# EasyEDA Pro project ProPrj_FOC_Driver V2.0_2024-06-09.epro, board PCB1
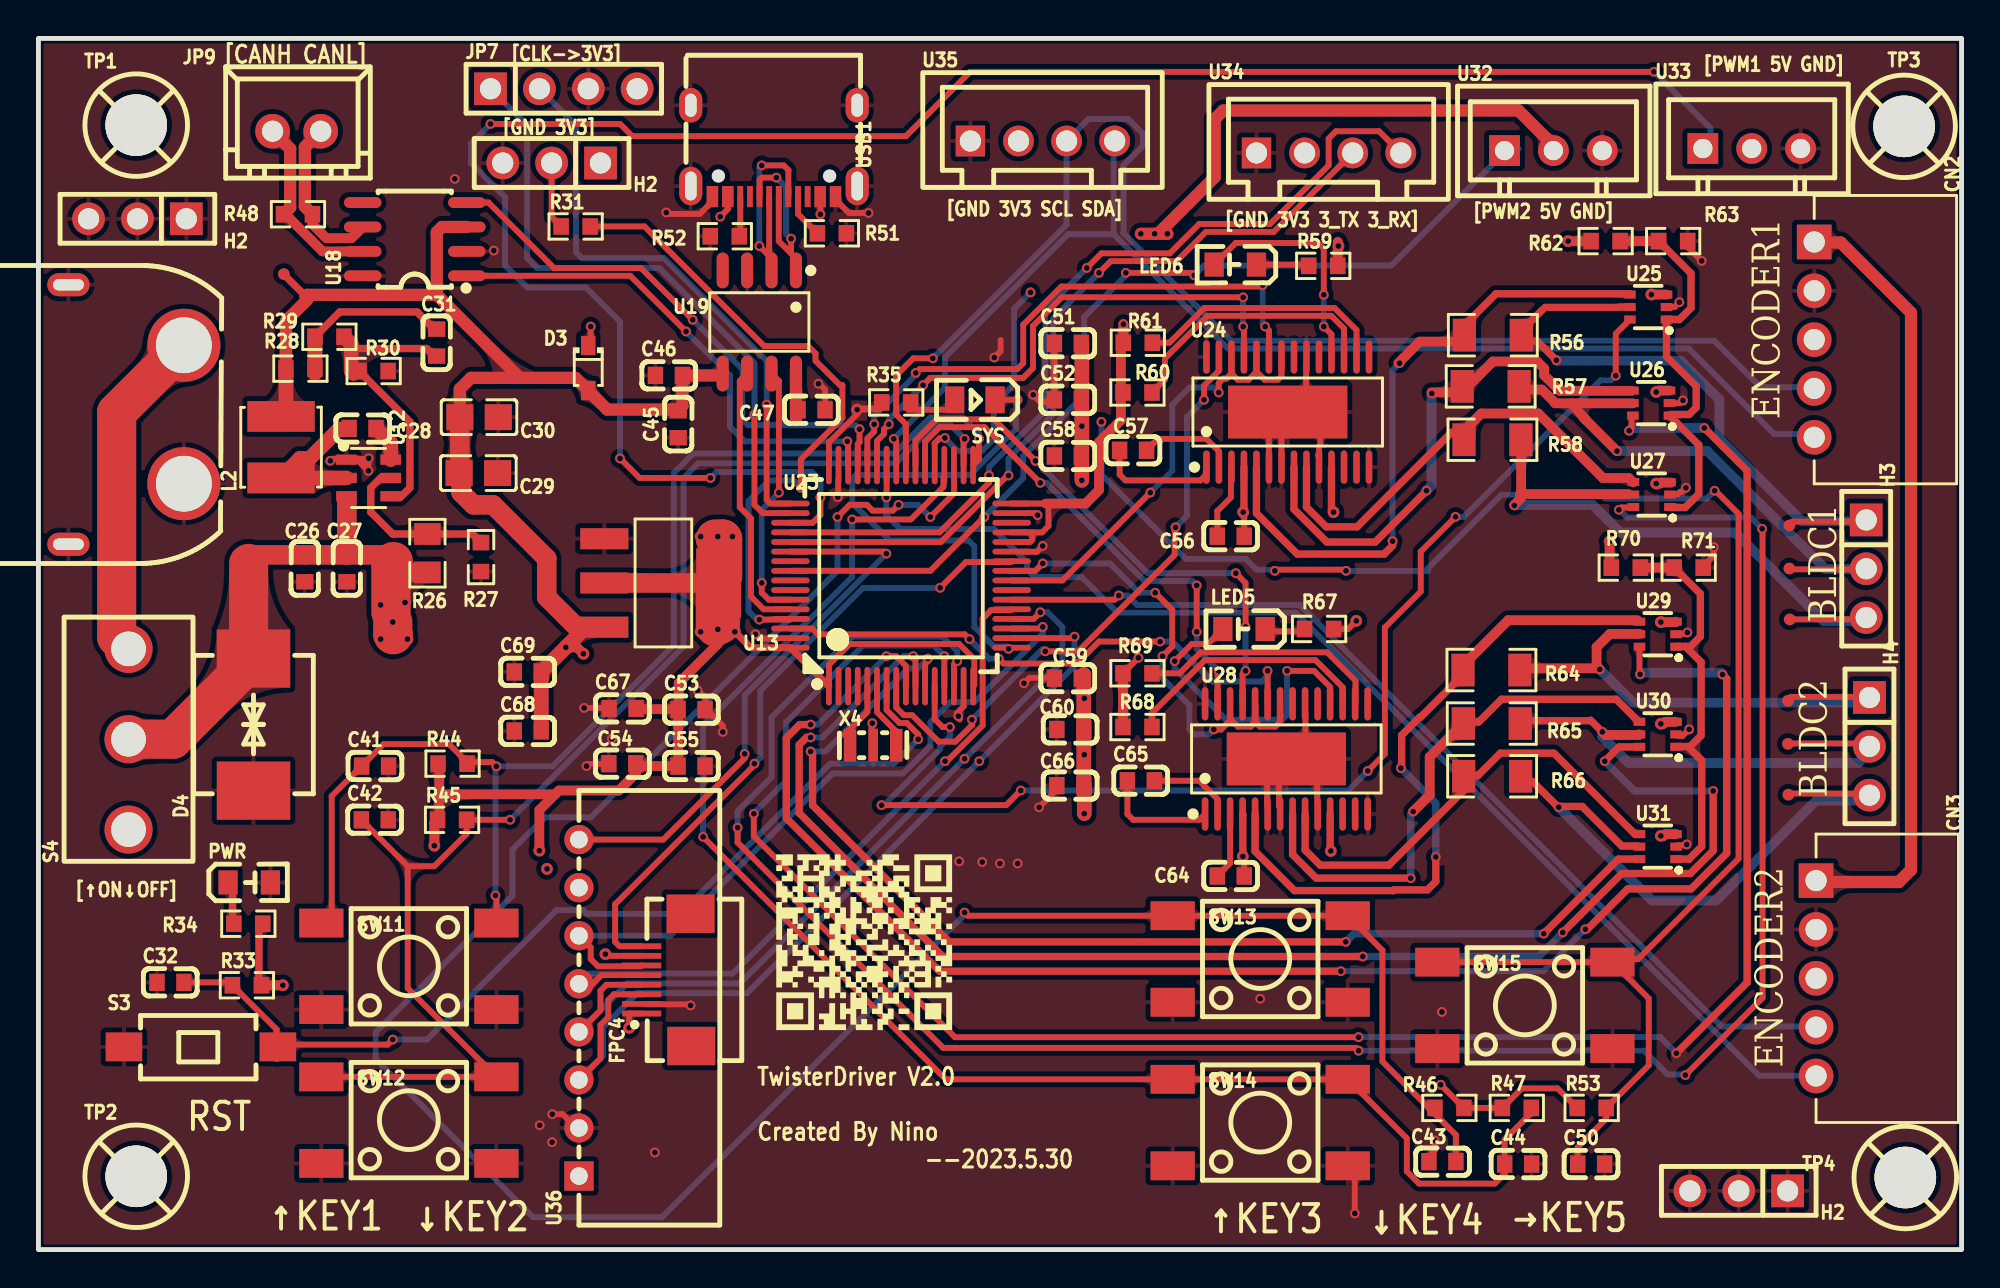
[diagram p2: board, top side]
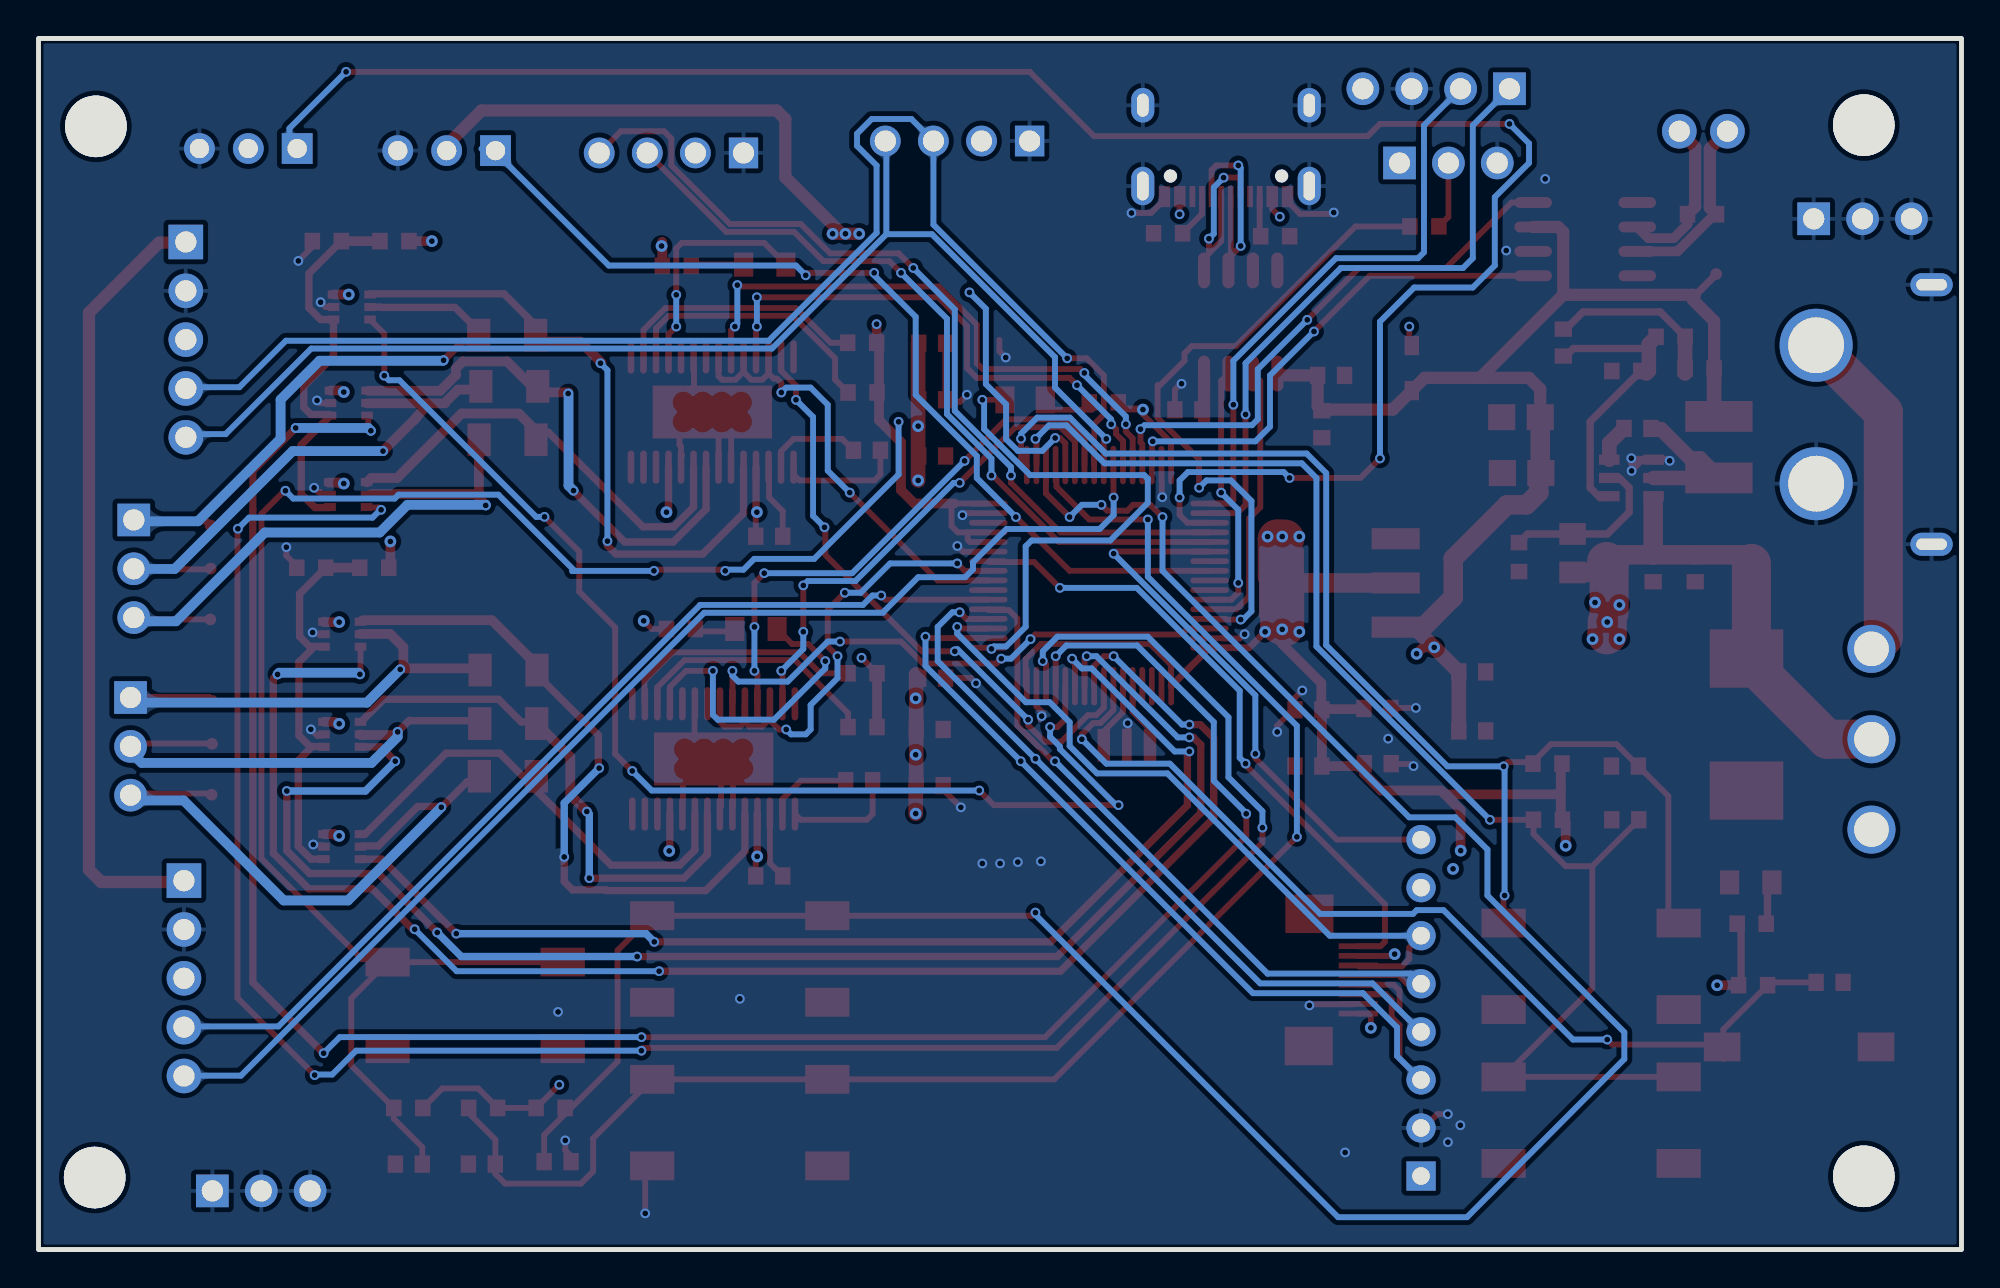
[diagram p3: board, bottom side, seen from below]

Outline 99.95 x 62.99 mm; copper layers: Top Layer, Inner1, Inner2, Bottom Layer. Coordinates in mm from the lower left corner of the outline.
Outline path: rectangle 0,62.99 99.95,0
Stack: Top Layer 0.035mm 外层铜厚1oz / Dielectric1 0.2104mm 7628 RC49% 8.6mil / Inner1 0.0152mm 内层铜厚 / Dielectric2 1.065mm 1.1mm H/HOZ 含铜 / Inner2 0.0152mm 内层铜厚 / Dielectric3 0.2104mm 7628 RC49% 8.6mil / Bottom Layer 0.035mm 外层铜厚1oz

## Design rules (mm)
template: JLCPCB Capability(Two Layers Board)
spacing copperThickness1oz (default): track to track 0.102, other pairs 0.152 to 0.3
spacing copperThickness2oz: track to track 0.203, other pairs 0.152 to 0.3
track width copperThickness1oz (default): min 0.127, default 0.254, max 2.54
track width copperThickness2oz: min 0.203, default 0.254, max 2.54
differential pair differentialPair (default): width min 0.127, default 0.254, max 2.54; gap min 0.152, default 0.152
via viaSize (default): diameter min 0.5, default 0.61, max 10; hole min 0.3, default 0.305, max 6.3

## Placement (name value [footprint] x y rotation side)
C26  100nF  [C0603]  13.84 35.43 90 top
C27  100nF  [C0603]  16.03 35.43 90 top
C28  100nF  [C0603]  16.84 42.71 180 top
C29  22uF  [C0805]  22.86 40.39 180 top
C30  22uF  [C0805]  22.9 43.3 180 top
C31  75pF  [C0603]  20.7 47.17 90 top
C32  100nF  [C0603]  6.86 13.9 0 top
C41  100nF  [C0603]  17.5 25.15 0 top
C42  100nF  [C0603]  17.48 22.35 0 top
C43  100nF  [C0603]  72.97 4.57 180 top
C44  100nF  [C0603]  76.91 4.45 0 top
C45  100nF  [C0603]  33.25 42.93 270 top
C46  100nF  [C0603]  32.77 45.47 0 top
C47  100nF  [C0603]  40.18 43.68 0 top
C50  100nF  [C0603]  80.7 4.44 0 top
C51  100nF  [C0603]  53.5 47.14 0 top
C52  100nF  [C0603]  53.5 44.2 0 top
C53  100nF  [C0603]  33.94 28.08 0 top
C54  100nF  [C0603]  30.34 25.27 180 top
C55  100nF  [C0603]  33.94 25.15 0 top
C56  100nF  [C0603]  61.97 37.1 0 top
C57  10nF  [C0603]  56.89 41.57 0 top
C58  100nF  [C0603]  53.5 41.28 0 top
C59  100nF  [C0603]  53.5 29.72 0 top
C60  100nF  [C0603]  53.63 27.05 0 top
C64  100nF  [C0603]  61.97 19.43 0 top
C65  10nF  [C0603]  57.29 24.38 0 top
C66  100nF  [C0603]  53.63 24.13 0 top
C67  100nF  [C0603]  30.36 28.14 0 top
C68  100nF  [C0603]  25.43 26.97 0 top
C69  10uF  [C0603]  25.43 30.04 0 top
CN1  XT60PW-M  [CONN-TH_XT60PW-M]  4.56 43.43 0 top
CN2  XH-5AW  [CONN-TH_5P-P2.54_XH-5AW_C2908614]  92.29 47.33 270 top
CN3  XH-5AW  [CONN-TH_5P-P2.54_XH-5AW_C2908614]  92.39 14.11 270 top
D3  B5819WS  [SOD-323_L1.8-W1.3-LS2.5-RD]  28.57 45.85 270 top
D4  SMDJ24CA  [SMC_L6.9-W5.9-LS7.9-BI]  11.18 27.31 90 top
FPC4  FPC-05F-8PH20  [fpc-smd_8p-p0.50_fpc-05f-8ph20]  32.64 14.03 90 top
H2  PZ254V-11-03P  [HDR-TH_3P-P2.54-V-M]  5.14 53.61 180 top
H2#2  -  [HDR-TH_3P-P2.54-V-M]  88.37 3.05 180 top
H2#3  -  [HDR-TH_3P-P2.54-V-M]  26.67 56.52 180 top
H3  PZ254V-11-03P  [HDR-TH_3P-P2.54-V-M]  95 35.41 270 top
H4  PZ254V-11-03P  [HDR-TH_3P-P2.54-V-M]  95.16 26.17 270 top
JP7  PZ254V-11-04P  [HDR-TH_4P-P2.54-V-M]  27.31 60.38 0 top
JP9  XH-2A  [CONN-TH_2P-P2.50_HCTL_XH-2A-X]  13.42 58.17 0 top
L2  15uH  [IND-SMD_L4.0-W4.0]  12.61 41.73 90 top
LED5  XL-2012SURC  [LED0805-RD_RED]  62.66 32.28 180 top
LED6  XL-2012SURC  [LED0805-RD_RED]  62.2 51.23 180 top
NOREF  -  [Pad_e16703]  12.75 50.74 0 top
NOREF#2  -  [Pad_e16310]  91.02 32.77 0 top
NOREF#3  -  [Pad_e16308]  91 37.66 0 top
NOREF#4  -  [Pad_e16314]  90.93 28.54 0 top
NOREF#5  -  [Pad_e16309]  91 35.42 0 top
NOREF#6  -  [Pad_e16313]  90.93 26.3 0 top
NOREF#7  -  [Pad_e16312]  90.95 23.66 0 top
PWR  XL-2012SURC  [LED0805-RD_RED]  10.95 19.09 0 top
R26  511kΩ  [R0805]  20.22 36.22 270 top
R27  105kΩ  [R0603]  23 36.02 90 top
R28  49.9Ω  [R0603]  13.61 45.82 180 top
R29  100kΩ  [R0603]  15.12 47.48 180 top
R30  13.3kΩ  [R0603]  17.42 45.69 180 top
R31  10kΩ  [R0603]  27.92 53.21 0 top
R33  10kΩ  [R0603]  10.83 13.75 0 top
R34  1kΩ  [R0603]  10.91 16.95 180 top
R35  1kΩ  [R0603]  44.58 44.06 0 top
R44  10kΩ  [R0603]  21.52 25.27 0 top
R45  10kΩ  [R0603]  21.5 22.35 0 top
R46  10kΩ  [R0603]  73.33 7.37 180 top
R47  10kΩ  [R0603]  76.84 7.37 0 top
R48  120Ω  [R0603]  13.49 53.85 180 top
R51  5.1kΩ  [R0603]  41.24 52.86 0 top
R52  5.1kΩ  [R0603]  35.67 52.71 180 top
R53  10kΩ  [R0603]  80.73 7.37 0 top
R56  10mΩ  [R1206]  75.59 47.56 180 top
R57  10mΩ  [R1206]  75.48 44.9 180 top
R58  10mΩ  [R1206]  75.57 42.12 180 top
R59  10kΩ  [R0603]  66.78 51.17 0 top
R60  10kΩ  [R0603]  57.12 44.58 180 top
R61  10kΩ  [R0603]  57.14 47.17 180 top
R62  10kΩ  [R0603]  81.45 52.45 180 top
R63  10kΩ  [R0603]  84.96 52.45 180 top
R64  10mΩ  [R1206]  75.52 30.14 180 top
R65  10mΩ  [R1206]  75.53 27.36 180 top
R66  10mΩ  [R1206]  75.55 24.62 180 top
R67  10kΩ  [R0603]  66.56 32.28 0 top
R68  10kΩ  [R0603]  57.12 27.18 180 top
R69  10kΩ  [R0603]  57.12 29.97 180 top
R70  10kΩ  [R0603]  82.5 35.47 180 top
R71  10kΩ  [R0603]  85.77 35.47 180 top
S3  TS-1101-C-W  [SW-SMD_L6.0-W3.3-LS8.0]  8.44 10.54 0 top
S4  SS-12D10L5  [SW-TH_SS-12D10L5]  4.68 26.54 90 top
SW11  -  [SW-SMD_4P-L6.0-W6.0-P4.50-LS9.0-2]  19.25 14.73 0 top
SW12  -  [SW-SMD_4P-L6.0-W6.0-P4.50-LS9.0-2]  19.25 6.73 0 top
SW13  -  [SW-SMD_4P-L6.0-W6.0-P4.50-LS9.0-2]  63.5 15.11 0 top
SW14  -  [SW-SMD_4P-L6.0-W6.0-P4.50-LS9.0-2]  63.5 6.6 0 top
SW15  -  [SW-SMD_4P-L6.0-W6.0-P4.50-LS9.0-2]  77.25 12.7 0 top
SYS  NCD0805G1  [LED0805-R-RD]  48.67 44.2 180 top
TP1  -  [M3螺丝]  5.14 58.42 0 top
TP2  -  [M3螺丝]  5.14 3.75 0 top
TP3  -  [M3螺丝]  97.03 58.36 0 top
TP4  -  [M3螺丝]  97.09 3.68 0 top
U12  TPS54202DDCR  [SOT-23-6_L2.9-W1.6-P0.95-LS2.8-BL]  17.16 40.13 270 top
U13  LM1117S-3.3  [SOT-223-3_L6.5-W3.4-P2.30-LS7.0-BR]  32.38 34.67 180 top
U18  TJA1050T/CM,118  [SOIC-8_L5.0-W4.0-P1.27-LS6.0-BL]  19.56 52.55 90 top
U19  CH340N  [SOP-8_L4.9-W3.9-P1.27-LS6.0-BL]  37.47 48.24 180 top
U23  STM32G431RBT6  [LQFP-64_L10.0-W10.0-P0.50-LS12.0-BL]  44.83 35.05 0 top
U24  DRV8313PWPR  [HTSSOP-28_L9.8-W4.5-P0.65-LS6.6-BL-EP]  64.93 43.56 0 top
U25  INA199A1DCKR  [SC-70-6_L2.2-W1.3-P0.65-LS2.1-BR]  83.67 49.02 0 top
U26  INA199A1DCKR  [SC-70-6_L2.2-W1.3-P0.65-LS2.1-BR]  83.82 44.03 0 top
U27  INA199A1DCKR  [SC-70-6_L2.2-W1.3-P0.65-LS2.1-BR]  83.85 39.27 0 top
U28  DRV8313PWPR  [HTSSOP-28_L9.8-W4.5-P0.65-LS6.6-BL-EP]  64.86 25.52 0 top
U29  INA199A1DCKR  [SC-70-6_L2.2-W1.3-P0.65-LS2.1-BR]  84.16 32 0 top
U30  INA199A1DCKR  [SC-70-6_L2.2-W1.3-P0.65-LS2.1-BR]  84.16 26.8 0 top
U31  INA199A1DCKR  [SC-70-6_L2.2-W1.3-P0.65-LS2.1-BR]  84.16 20.96 0 top
U32  ZX-XH2.54-3PZZ  [CONN-TH_3P-P2.54_2501S-3P]  78.74 57.16 0 top
U33  ZX-XH2.54-3PZZ  [CONN-TH_3P-P2.54_2501S-3P]  89.04 57.27 0 top
U34  ZX-XH2.54-4PZZ  [CONN-TH_4P-P2.50_4PIN]  67.06 57.04 0 top
U35  ZX-XH2.54-4PZZ  [CONN-TH_4P-P2.50_4PIN]  52.19 57.66 0 top
U36  ZX-XH2.54-8PWZ  [CONN-TH_8P-P2.50_ZX-XH2.54-8PWZ]  28.09 12.57 90 top
USB1  TYPE-C 16PIN 2MD(073)  [USB-C-SMD_TYPE-C-6PIN-2MD-073]  38.23 57.14 180 top
X4  8MHz  [OSC-SMD_3P-L3.2-W1.3-P1.2-L]  43.38 26.23 0 top

## Footprints (pads in the part's own frame, mm; a bottom-side part is the same pattern mirrored in y, then rotated)
C0603
  rect 0.8x0.9 smd: 1(-0.7,0) 2(0.7,0)
C0805
  rect 1.41x1.35 smd: 1(-1,0) 2(1,0)
CONN-TH_2P-P2.50_HCTL_XH-2A-X
  round 1.8 hole 1.1: 1(-1.251,0) 2(1.251,0)
CONN-TH_3P-P2.54_2501S-3P
  rect 1.6x1.6 hole 1: 1(-2.54,0)
  round 1.6 hole 1: 2(0,0) 3(2.54,0)
CONN-TH_4P-P2.50_4PIN
  rect 1.524x1.6 hole 1.1: 1(-3.75,0)
  round 1.6 hole 1.1: 2(-1.25,0) 3(1.25,0) 4(3.75,0)
CONN-TH_5P-P2.54_XH-5AW_C2908614
  rect 1.8x1.8 hole 1.1: 1(-5.08,0)
  round 1.8 hole 1.1: 2(-2.54,0) 3(0,0) 4(2.54,0) 5(5.08,0)
CONN-TH_8P-P2.50_ZX-XH2.54-8PWZ
  rect 1.524x1.524 hole 0.914: 1(-8.75,0)
  round 1.524 hole 0.914: 2(-6.25,0) 3(-3.75,0) 4(-1.25,0) 5(1.25,0) 6(3.75,0) 7(6.25,0) 8(8.75,0)
CONN-TH_XT60PW-M
  round 3.8 hole 2.9: 1(3,-3.6) 2(3,3.6)
  oval 2.2x1.2 hole 1.6x0.6: 3(-3,6.75) 4(-3,-6.75)
fpc-smd_8p-p0.50_fpc-05f-8ph20
  rect 0.3x2.032 smd: 1(-1.75,1.288) 2(-1.25,1.288) 3(-0.75,1.288) 4(-0.25,1.288) 5(0.25,1.288) 6(0.75,1.288) 7(1.25,1.288) 8(1.75,1.288)
  rect 2x2.5 smd: 9(3.44,-1.252) 10(-3.44,-1.288)
HDR-TH_3P-P2.54-V-M
  rect 1.7x1.7 hole 1.1: 1(-2.54,0)
  round 1.7 hole 1.1: 2(0,0) 3(2.54,0)
HDR-TH_4P-P2.54-V-M
  rect 1.7x1.7 hole 1.1: 1(-3.81,0)
  round 1.7 hole 1.1: 2(-1.27,0) 3(1.27,0) 4(3.81,0)
HTSSOP-28_L9.8-W4.5-P0.65-LS6.6-BL-EP
  oval 0.343x1.732 smd: 1(-4.225,-2.866) 2(-3.575,-2.866) 3(-2.925,-2.866) 4(-2.275,-2.866) 5(-1.625,-2.866) 6(-0.975,-2.866) 7(-0.325,-2.866) 8(0.325,-2.866) 9(0.975,-2.866) 10(1.625,-2.866) 11(2.275,-2.866) 12(2.925,-2.866) 13(3.575,-2.866) 14(4.225,-2.866) 15(4.225,2.866) 16(3.575,2.866) 17(2.925,2.866) 18(2.275,2.866) 19(1.625,2.866) 20(0.975,2.866) 21(0.325,2.866) 22(-0.325,2.866) 23(-0.975,2.866) 24(-1.625,2.866) 25(-2.275,2.866) 26(-2.925,2.866) 27(-3.575,2.866) 28(-4.225,2.866)
  rect 6.2x2.75 smd: 29(0,0)
IND-SMD_L4.0-W4.0
  rect 1.6x3.5 smd: 1(-1.6,0) 2(1.6,0)
LED0805-R-RD
  rect 1x1.399 smd: 1(1.05,0) 2(-1.05,0)
LED0805-RD_RED
  rect 1x1.25 smd: 1(-1.1,0) 2(1.1,0)
LQFP-64_L10.0-W10.0-P0.50-LS12.0-BL
  oval 0.3x2 smd: 1(-3.75,-5.75) 2(-3.25,-5.75) 3(-2.75,-5.75) 4(-2.25,-5.75) 5(-1.75,-5.75) 6(-1.25,-5.75) 7(-0.75,-5.75) 8(-0.25,-5.75) 9(0.25,-5.75) 10(0.75,-5.75) 11(1.25,-5.75) 12(1.75,-5.75) 13(2.25,-5.75) 14(2.75,-5.75) 15(3.25,-5.75) 16(3.75,-5.75) 33(3.75,5.75) 34(3.25,5.75) 35(2.75,5.75) 36(2.25,5.75) 37(1.75,5.75) 38(1.25,5.75) 39(0.75,5.75) 40(0.25,5.75) 41(-0.25,5.75) 42(-0.75,5.75) 43(-1.25,5.75) 44(-1.75,5.75) 45(-2.25,5.75) 46(-2.75,5.75) 47(-3.25,5.75) 48(-3.75,5.75)
  oval 2x0.3 smd: 17(5.75,-3.75) 18(5.75,-3.25) 19(5.75,-2.75) 20(5.75,-2.25) 21(5.75,-1.75) 22(5.75,-1.25) 23(5.75,-0.75) 24(5.75,-0.25) 25(5.75,0.25) 26(5.75,0.75) 27(5.75,1.25) 28(5.75,1.75) 29(5.75,2.25) 30(5.75,2.75) 31(5.75,3.25) 32(5.75,3.75) 49(-5.75,3.75) 50(-5.75,3.25) 51(-5.75,2.75) 52(-5.75,2.25) 53(-5.75,1.75) 54(-5.75,1.25) 55(-5.75,0.75) 56(-5.75,0.25) 57(-5.75,-0.25) 58(-5.75,-0.75) 59(-5.75,-1.25) 60(-5.75,-1.75) 61(-5.75,-2.25) 62(-5.75,-2.75) 63(-5.75,-3.25) 64(-5.75,-3.75)
M3螺丝
  round 3.2 hole 3.2: 1(-0.064,0.064)
OSC-SMD_3P-L3.2-W1.3-P1.2-L
  rect 0.65x1.7 smd: 1(-1.2,0) 3(1.2,0)
  rect 0.5x1.7 smd: 2(0,0)
Pad_e16308
  round 0.61 smd: TP7(0,0)
Pad_e16309
  round 0.61 smd: TP8(0,0)
Pad_e16310
  round 0.61 smd: TP9(0,0)
Pad_e16312
  round 0.61 smd: TP9(0,0)
Pad_e16313
  round 0.61 smd: TP8(0,0)
Pad_e16314
  round 0.61 smd: TP7(0,0)
Pad_e16703
  round 0.61 smd: TP12(0,0)
R0603
  rect 0.806x0.864 smd: 1(-0.753,0) 2(0.753,0)
R0805
  rect 1.133x1.377 smd: 1(-1,0) 2(1,0)
R1206
  rect 1.208x1.701 smd: 1(-1.479,0) 2(1.479,0)
SC-70-6_L2.2-W1.3-P0.65-LS2.1-BR
  rect 0.6x0.42 smd: 1(0.95,-0.65) 2(0.95,0) 3(0.95,0.65) 4(-0.95,0.65) 5(-0.95,0) 6(-0.95,-0.65)
SMC_L6.9-W5.9-LS7.9-BI
  rect 3.03x3.82 smd: 1(-3.435,0) 2(3.435,0)
SOD-323_L1.8-W1.3-LS2.5-RD
  rect 1x0.75 smd: 1(-1.173,0) 2(1.173,0)
SOIC-8_L5.0-W4.0-P1.27-LS6.0-BL
  oval 0.569x1.95 smd: 1(-1.905,-2.705) 2(-0.635,-2.705) 3(0.635,-2.705) 4(1.905,-2.705) 5(1.905,2.705) 6(0.635,2.705) 7(-0.635,2.705) 8(-1.905,2.705)
SOP-8_L4.9-W3.9-P1.27-LS6.0-BL
  oval 0.63x1.865 smd: 1(-1.905,-2.683) 2(-0.635,-2.683) 3(0.635,-2.683) 4(1.905,-2.683) 5(1.905,2.683) 6(0.635,2.683) 7(-0.635,2.683) 8(-1.905,2.683)
SOT-23-6_L2.9-W1.6-P0.95-LS2.8-BL
  rect 0.532x1.072 smd: 1(-0.95,-1.149) 2(0,-1.149) 3(0.95,-1.149) 4(0.95,1.149) 5(0,1.149) 6(-0.95,1.149)
SOT-223-3_L6.5-W3.4-P2.30-LS7.0-BR
  rect 2.5x1.1 smd: 1(2.97,-2.3) 2(2.97,0) 3(2.97,2.3)
  rect 2.34x3.6 smd: 4(-2.97,0)
SW-SMD_4P-L6.0-W6.0-P4.50-LS9.0-2
  rect 2.3x1.5 smd: 1(-4.55,2.25) 2(4.55,2.25) 3(-4.55,-2.25) 4(4.55,-2.25)
SW-SMD_L6.0-W3.3-LS8.0
  rect 1.9x1.5 smd: 1(-4,0) 2(4,0)
SW-TH_SS-12D10L5
  round 2.5 hole 1.8: 1(-4.7,0) 2(0,0) 3(4.7,0)
USB-C-SMD_TYPE-C-6PIN-2MD-073
  rect 0.6x1.1 smd: 1(-3.2,2.375) 2(-2.4,2.375) 11(2.4,2.375) 12(3.2,2.375)
  rect 0.3x1.1 smd: 3(-1.75,2.375) 4(-1.25,2.375) 5(-0.75,2.375) 6(-0.25,2.375) 7(0.25,2.375) 8(0.75,2.375) 9(1.25,2.375) 10(1.75,2.375)
  oval 1.2x2 hole 0.6x1.5: 13(-4.325,1.825) 14(4.325,1.825)
  oval 1.2x1.8 hole 0.6x1.2: 13(-4.325,-2.375) 14(4.325,-2.375)

## Nets
As in the schematic, except:
+3V3: C53.1 C54.1 C55.1 C67.2 FPC4.1 FPC4.7 H2#3.1 JP7.4 R33.2 R34.1 R35.1 R44.1 R45.1 R46.1 R47.1 R53.1 R59.2 R60.2 R61.2 R62.2 R67.2 R68.2 R69.2 R70.2 U13.2 U13.4 U23.1 U23.16 U23.28 U23.29 U23.32 U23.48 U23.64 U25.3 U26.3 U27.3 U29.3 U30.3 U31.3 U34.2 U35.2 U36.1 U36.7
GND: C26.1 C27.1 C29.1 C30.1 C32.1 C41.2 C42.2 C43.2 C44.2 C45.2 C46.1 C47.2 C50.2 C51.1 C52.1 C53.2 C54.2 C55.2 C58.1 C59.1 C60.1 C66.1 C67.1 C68.1 C69.1 CN1.1 CN1.3 CN1.4 CN2.2 CN3.2 D4.1 FPC4.2 H2.1 H2.2 H2.3 H2#2.1 H2#2.2 H2#2.3 H2#3.3 JP7.3 PWR.2 R27.1 R30.1 R51.2 R52.2 R63.1 R71.1 S3.1 SW11.3 SW11.4 SW12.3 SW12.4 SW13.3 SW13.4 SW14.3 SW14.4 SW15.3 SW15.4 U12.1 U13.1 U18.2 U18.8 U19.3 U23.15 U23.27 U23.31 U23.47 U23.63 U24.6 U24.7 U24.10 U24.14 U24.20 U24.28 U24.29 U25.2 U26.2 U27.2 U28.6 U28.7 U28.10 U28.14 U28.20 U28.28 U28.29 U29.2 U30.2 U31.2 U32.3 U33.3 U34.1 U35.1 U36.2 USB1.1 USB1.12 USB1.13 USB1.14 X4.2
+5: C29.2 C30.2 C45.1 C46.2 C68.2 C69.2 CN2.1 CN3.1 D3.2 L2.2 NOREF.TP12 R28.2 U13.3 U18.3 U19.5 U32.2 U33.2
OUT1: H3.1 NOREF#3.TP7 R56.1 U25.5
OUT2: H3.2 NOREF#5.TP8 R57.1 U26.5
OUT2_1: H4.1 NOREF#4.TP7 R64.1 U29.5
OUT2_2: H4.2 NOREF#6.TP8 R65.1 U30.5
OUT2_3: H4.3 NOREF#7.TP9 R66.1 U31.5
OUT3: H3.3 NOREF#2.TP9 R58.1 U27.5
$1N16306: H2#3.2 R31.1

Pads without a net: CN2 3; CN3 3; FPC4 9 10; S4 1; TP1 1; TP2 1; TP3 1; TP4 1; U18 5; U19 4; U23 2 3 4 30 55; U24 12 13 15 19 21; U28 12 13 15 19 21; USB1 3 9

## Via types
v1: diameter 0.508, hole 0.305, Top Layer to Bottom Layer, 193 vias
v2: diameter 0.61, hole 0.305, Top Layer to Bottom Layer, 42 vias

## Routing (per net, layer and track width the routed paths; a pad name or vN(x,y) marks a point on that pad's centre or on a via; arc(x,y) is an arc through that point)
+1.65V: length 20.9
  Top Layer w0.381: 84.87,38.59 85.59,38.59 86.29,39.3 86.29,41.86 U26.1 84.83,43.43 85.79,43.43 86.16,43.8 86.16,44.91 84.62,46.45 U25.1 85.28,48.37 85.89,48.98 85.89,50.77 R63.2
  Top Layer w0.508: 82.2,52.45 R63.2
+1.65V_2: length 21
  Top Layer w0.381: R71.2 86.38,34.11 86.38,31.89 85.86,31.37 85.6,31.37 ; U29.1 85.13,31.37 85.6,31.37 ; U30.1 85.13,26.16 85.72,26.16 ; 85.6,31.37 86.41,30.55 86.41,26.74 85.84,26.16 85.72,26.16 ; U31.1 85.78,20.31 86.45,20.97 86.45,25.44 85.72,26.16
  Top Layer w0.508: R70.1 R71.2
+3V3: length 356.7
  Top Layer w0.305: FPC4.1 30.7,12.28 v2(30.7,11.53) ; R67.2 68.07,32.28 v2(68.49,32.7) ; 51.65,37.3 52.17,37.3 52.49,37.63 52.49,38.66 52.35,38.8 U23.32 ; 51.65,37.3 U23.29 ; 51.65,37.3 51.65,36.92 51.53,36.8 U23.28 ; FPC4.7 29.56,15.28 v2(29.46,15.37) ; U23.48 41.08,41.98 42.54,43.44 v2(42.54,43.69) ; v1(72.88,8.57) R46.1 R47.1 77.1,8.38 78.96,8.38 R53.1 ; U23.1 41.08,30.41 42.16,31.5 47.85,31.5 48.64,30.71 48.64,29.36 U23.16 ; v1(57.17,30.78) 56.37,29.97
  Top Layer w0.355: 43.7,43.72 42.58,43.72 v2(42.54,43.69) ; U23.1 U23.64 37.02,31.3 v2(36.19,32.13)
  Top Layer w0.381: 11.46,13.77 11.46,16.92 11.61,17.07
  Top Layer w0.508: R62.2 v2(79.5,52.45) ; v2(36.19,32.13) 36.19,33.83 U13.4 36.07,35.39 v2(36.07,37.08) ; v2(84.32,21.52) 84.47,21.52 84.56,21.61 U31.3 ; v2(84.32,27.35) 84.46,27.35 84.56,27.45 U30.3 ; v2(12.7,13.75) R33.2 ; v2(84.32,32.63) 85.09,32.63 U29.3 ; v2(81.66,36.83) 81.66,35.51 81.62,35.47 ; v2(83.83,49.67) U25.3 ; v2(35.31,32.26) 35.31,31.5 33.27,29.46 33.27,28.11 ; R59.2 67.53,52.16 ; 67.53,52.16 67.53,52.42 ; 67.53,52.16 v2(67.56,52.2) ; 33.27,28.11 31.09,28.11 C67.2 ; 33.27,28.11 C53.1 C55.1 31.2,25.15 31.06,25.29 ; v2(84.08,39.84) 84.26,39.84 84.32,39.89 84.87,39.89 ; 26.85,23.68 26.03,22.86 v2(26.03,20.75) ; 26.85,23.68 27.05,23.88 30.16,23.88 31.06,24.77 31.06,25.29 ; 26.85,23.68 21.03,23.68 20.83,23.88 ; v1(56.39,48.13) 56.39,47.17 R61.2 56.26,47.04 56.26,43.14 55.12,41.99 55.12,39.5 54.42,38.8 52.35,38.8 ; 56.37,29.97 56.37,27.18 ; 20.83,23.88 20.83,22.44 R45.1 20.57,22.18 v2(20.57,21) ; 20.83,23.88 20.83,25.21 R44.1 ; 31.06,25.29 C54.1 ; v2(84.08,44.6) 84.14,44.6 84.22,44.68 84.77,44.68
  Top Layer w1.016: U13.2 U13.4
  Top Layer w2.032: 35.43,32.51 35.31,32.64 35.31,34.67 ; 35.18,32.39 35.18,34.67 35.56,35.05 35.56,36.96 35.18,36.96
  Inner1 w0.305: v2(84.32,21.52) 75.5,21.52 70.87,16.88 70.87,9.53 71.5,8.89 72.56,8.89 v1(72.88,8.57) R46.1
  Inner1 w0.355: v2(29.46,15.37) 29.61,15.22
  Inner1 w0.508: v1(57.17,30.78) 57.17,31.44 59.05,33.31 67.88,33.31 v2(68.49,32.7) 69.38,33.59 69.38,38.32 71.58,40.51 83.82,40.51 83.95,40.39 83.95,39.97 v2(84.08,39.84) ; v2(84.08,39.84) 84.08,38.61 82.3,36.83 v2(81.66,36.83) 81.66,34.8 82.55,33.91 83.82,33.91 84.32,33.41 v2(84.32,32.63) v2(84.32,27.35) v2(84.32,21.52) ; v2(84.08,39.84) v2(84.08,44.6) 83.83,44.85 v2(83.83,49.67) 83.21,50.29 81.66,50.29 v2(79.5,52.45) 79.38,52.58 67.56,52.58 v2(67.56,52.2) ; 20.57,22.23 v2(20.57,21) 20.57,19.81 14.51,13.75 v2(12.7,13.75) R33.2 ; U36.7 27.41,18.82 v2(26.43,19.8) 26.43,13.2 27.05,12.57 28.96,12.57 29.34,12.19 30.59,12.19 ; v2(30.7,11.53) 30.7,12.16
  Inner1 w0.635: U36.7 29.46,17.45 v2(29.46,15.37) ; v2(26.03,20.75) 26.03,20.2 v2(26.43,19.8) ; v2(30.7,11.53) 30.7,6.43 U36.1
  Inner1 w0.762: 65.53,54.61 67.56,52.58 ; 65.53,54.61 64.65,53.73 60.12,53.73 ; 65.53,54.61 65.53,56.76 U34.2 ; 50.94,53.73 49.28,52.07 49.15,52.07 43.43,57.79 31.75,57.79 31.12,58.42 ; 50.94,53.73 60.12,53.73 ; 50.94,53.73 U35.2 ; 60.12,53.73 60.12,51.87 v1(56.39,48.13) ; 31.12,58.42 H2#3.1 ; 31.12,58.42 JP7.4
  Inner1 w1.016: 49.28,52.07 45.97,48.77 44.2,48.77 43.57,48.14 43.57,46.19 42.54,45.16 v2(42.54,43.69) 39.24,43.69 36.07,40.51 v2(36.07,37.08)
  vias: v2(34.42,37.08) v2(34.42,32.13) v2(35.31,37.08)
GND: length 54.9
  Top Layer w0.305: v1(32.63,53.94) 32.7,53.86 34.37,53.86 34.98,54.47 ; 68.19,4.32 68.42,4.09 v1(68.42,1.88) ; 85.31,39.4 85.2,39.29 84.95,39.29 ; 85.31,39.4 85.38,39.4 ; 85.31,39.4 85.38,39.4 ; 85.22,26.72 85.46,26.72 v1(85.79,27.06) ; 86.52,35.54 87.07,36.09 v1(87.07,36.53) ; v1(15.17,41.02) 15.27,41.13 17.13,41.13 17.15,41.14 ; 85.62,52.54 85.62,52.25 v1(86.44,51.42) ; 34.67,28.02 34.67,28.67 v1(34.26,29.08) ; 34.77,28.05 35.57,27.25 v1(35.57,26.92) ; v1(43.34,27.38) 43.31,27.35 43.31,26.42 ; 16.15,41.06 16.59,41.06 v1(17.15,40.5) 17.15,40.89 ; v1(43.14,53.91) 42.12,53.91 41.48,54.55 ; 63.86,23.09 63.86,24.3 63.82,24.33 ; 37.32,31.98 37.52,31.78 38.42,31.78 ; 84.66,49.03 85.04,49.03 v1(85.28,49.27) ; v1(28.36,28.17) 29.32,28.17 29.42,28.07 ; v1(72.57,5.68) 72.57,5.17 72.11,4.71 ; 31.56,12.75 33.83,12.75 33.85,12.73 ; v1(49.68,46.4) 50.01,46.72 50.01,47.31 ; 66.51,24.34 66.46,24.3 66.46,23.34 ; 84.77,44.02 85.33,44.02 v1(85.47,44.17) ; 48.08,28.47 48.08,28.25 47.74,27.9 47.74,27.73 47.88,27.59 47.88,27.7 47.8,27.78 ; 85.38,39.4 85.4,39.4 v1(85.62,39.62) ; 65.85,27.9 65.85,26.38 ; 85.08,32.02 85.63,32.02 v1(85.7,32.1) ; 29.69,25.25 28.59,25.25 v1(28.48,25.15) ; 52.98,24.21 52.98,23.97 v1(52.01,23) ; 51.43,38.3 51.82,38.3 v1(51.93,38.2) ; 52.82,47.2 52.82,44.09 ; 52.82,44.09 52.06,44.09 51.74,44.41 ; 52.82,44.09 52.8,44.08 ; 51.09,36.29 51.89,36.29 v1(52.19,36.59) ; 66.5,41.32 66.56,41.38 66.56,41.77 66.63,41.84 66.63,42.49 ; 64.4,24.25 64.47,24.17 64.47,23.04 ; v1(85.67,21.07) 85.63,21.03 85.17,21.03 ; 16.95,40.96 17.07,40.96 17.15,40.89 ; 63.95,41.26 63.95,42.69 ; 52.74,29.73 51.5,29.73 v1(51.22,29.45) ; 17.15,41.14 17.15,40.89 ; 17.15,41.14 v1(17.16,41.16) ; v1(26.7,7.04) 27.24,7.04 27.99,6.29 ; 40.88,43.7 40.88,44.73 40.56,45.05 ; 65.88,45.99 65.88,44.46 ; 64.6,41.29 64.6,42.48 ; 41.56,40.02 41.56,39.09
  vias: v1(21.64,55.69) v1(23.66,51.96) v1(26.05,6.46) v1(26.69,5.59) v1(29.8,26.57) v1(32.04,5.05) v1(33.89,12.7) v1(37.26,32.01) v1(40.54,45.03) v1(41.54,39.13) v1(47.81,27.74) v1(47.85,20.19) v1(49.05,20.15) v1(49.97,20.08) v1(50.89,20.08) v1(51.69,44.46) v1(63.5,13.04) v1(72.94,12.36)
VBUS: length 23
  Top Layer w0.305: D3.1 28.7,47.15 v1(28.7,48.01) ; v1(40.64,53.85) 40.64,54.75 USB1.2 ; v1(35.43,53.72) 35.83,54.12 USB1.11
  Inner1 w0.305: v1(40.64,53.85) 40.13,53.85 40,53.98 40,56.52 39.5,57.02 36.83,57.02 36.19,56.39 36.19,55.12 35.81,54.74 35.81,54.1 v1(35.43,53.72) 34.04,53.72 28.7,48.39 v1(28.7,48.01)
+5: length 210.8
  Top Layer w0.381: 12.79,50.68 13.89,49.58
  Top Layer w0.508: v2(27.41,31.32) 27.99,31.32 v2(28.32,30.99)
  Top Layer w0.635: 13.89,49.58 13.97,49.5 13.93,49.45 ; 13.89,49.58 13.96,49.66 20.7,49.66 ; 13.89,49.58 14.06,49.58 14.1,49.62 ; 20.7,49.66 20.7,52.92 20.97,53.19 U18.3 ; 20.7,49.66 25.02,45.34 ; 78.93,57.24 76.92,59.24 61.58,59.24 61.13,58.8 61.13,55.77 58.35,53 ; 13.98,49.41 12.86,48.29 R28.2 ; 25.02,45.34 22.48,45.34 21.9,44.76 C30.2 ; 25.02,45.34 27.91,45.34 D3.2 29.56,43.69 33.27,43.69 33.47,43.88 C46.2 35.46,45.47 U19.5 ; v2(58.67,52.83) v2(58.01,52.83) v2(57.29,52.83) ; 92.07,19.12 96.69,19.12 97.33,19.75 97.33,48.72 93.67,52.38 92,52.38 91.89,52.48
  Top Layer w0.762: C68.2 C69.2 v2(27.41,31.32) 28.46,32.37 ; R28.2 12.86,43.59 L2.2
  Top Layer w1.016: C29.2 21.9,40.42 C30.2 ; 21.97,40.13 21.97,39.37 22.61,38.74 23.62,38.74 26.42,35.94 26.42,33.93 27.97,32.37 U13.3
  Inner1 w0.635: v2(28.32,30.99) 33.91,30.99 40.89,24 49.53,24 53.12,27.6 53.12,50.84 55.12,52.83 v2(57.29,52.83)
  Inner1 w0.762: 89.52,57.02 88.92,57.02 87.27,55.38 80.33,55.38 79.08,56.63 79.08,57.21 ; 91.86,52.48 90.98,53.36 90.98,55.68 89.46,57.21
BOOT0: length 34.4
  Top Layer w0.305: R31.2 31.5,53.21 37.72,46.99 40,46.99 40.39,46.61 40.39,46.23 41.66,44.96 41.78,44.96 41.78,43.26 39.62,41.1 v1(39.62,39.62) ; v1(37.47,32.77) 39.04,32.77 U23.61
  Bottom Layer w0.305: v1(39.62,39.62) 39.24,40.01 37.97,40.01 36.91,38.94 36.91,33.2 37.34,32.77 v1(37.47,32.77)
CAN_RX: length 28.7
  Top Layer w0.305: U23.45 42.58,41.9 42.67,41.99 v1(42.67,42.67) ; U18.4 23.39,54.46 26.79,51.05 31.31,51.05 v1(34.01,48.36)
  Bottom Layer w0.305: v1(42.67,42.67) 42.47,42.88 36.88,42.88 36.58,43.18 36.58,45.79 v1(34.01,48.36)
CAN_TX: length 26.2
  Top Layer w0.305: v1(42.04,42.04) 42.08,41.99 U23.46 ; U18.1 30.76,50.65 v1(33.66,47.75)
  Bottom Layer w0.305: v1(42.04,42.04) 36.7,42.04 35.94,42.8 35.94,45.47 v1(33.66,47.75)
CANH: length 9.8
  Top Layer w0.508: U18.7 14.76,51.92 12.83,53.85 R48.2
  Top Layer w0.635: R48.2 13.08,54.2 13.08,57.25 JP9.1
CANL: length 8.5
  Top Layer w0.508: U18.6 16.27,52.61 14.96,52.61 14.24,53.32 R48.1
  Top Layer w0.635: R48.1 13.84,54.25 13.84,57.34 JP9.2
CS1: length 64
  Top Layer w0.305: v1(47.37,27.18) 46.99,27.18 46.58,27.59 U23.12 ; U25.6 81.98,47.63 v1(81.98,45.45) ; v1(73.65,38.11) 71.84,36.3 71.84,34.22 69.98,32.35 69.98,25.78 v1(69.09,24.89) ; v1(43.81,23.11) 50.29,23.11 v1(51.05,23.88)
  Bottom Layer w0.305: v1(73.65,38.11) 74.08,38.11 81.18,45.21 81.74,45.21 v1(81.98,45.45) ; v1(51.05,23.88) 68.07,23.88 v1(69.09,24.89) ; v1(47.37,27.18) 47.37,26.67 46.86,26.16 46.86,26.04 43.94,23.11 v1(43.81,23.11)
CS2: length 110.7
  Top Layer w0.305: v1(37.18,22.66) 37.18,21.5 47.63,11.04 68.61,11.04 ; U23.13 v1(47.08,30.86) ; v1(82.67,42.59) 82.81,42.72 82.81,43.41
  Top Layer w0.381: v1(85.13,10.21) 88.81,13.89 88.81,40.51 v1(86.58,42.73)
  Bottom Layer w0.305: v1(85.13,10.21) 84.29,11.05 v1(68.61,11.05) ; v1(47.08,30.86) 46.52,31.42 42.85,31.42 38.86,27.43 38.86,24.38 37.18,22.7 v1(37.18,22.66)
  Bottom Layer w0.508: v1(82.67,42.59) 82.82,42.73 v1(86.58,42.73)
CS2_1: length 83.3
  Top Layer w0.305: v1(83.24,29.92) 83.21,29.95 83.21,31.35 ; 45.09,29.31 U23.9 45.08,30.36 44.58,30.86 v1(44.07,30.86)
  Top Layer w0.381: v1(80.4,16.66) 80.5,16.66 82.6,18.76 85.89,18.76 87.74,20.61 87.74,29.69 v1(87.52,29.92) ; v1(40.13,27.31) 39.56,27.31 38.87,26.61 38.87,22.44 46.83,14.48 v1(67.69,14.48)
  Bottom Layer w0.305: v1(67.69,14.48) 78.22,14.48 v1(80.4,16.66) ; v1(44.07,30.86) 40.51,27.31 v1(40.13,27.31)
  Bottom Layer w0.508: v1(87.52,29.92) 87.44,30 83.33,30 v1(83.24,29.92)
CS2_2: length 77.4
  Top Layer w0.305: U23.10 45.58,30.75 v1(45.47,30.86)
  Top Layer w0.381: v1(79.22,16.49) 82.29,19.56 85.85,19.56 87.04,20.75 v1(87.04,23.85) ; v1(81.41,25.4) 82.15,26.15 83.21,26.15 ; v1(40.13,26.64) 39.92,26.64 39.54,26.26 39.54,22.71 47,15.24 v1(68.83,15.24)
  Bottom Layer w0.305: v1(45.47,30.86) 44.96,30.86 40.73,26.64 v1(40.13,26.64)
  Bottom Layer w0.381: v1(79.22,16.49) 77.97,15.24 v1(68.83,15.24) ; v1(81.41,25.4) 82.96,23.85 v1(87.04,23.85)
CS2_3: length 60.1
  Top Layer w0.305: U23.11 46.08,30.46 46.23,30.61 v1(46.23,30.73)
  Top Layer w0.381: v1(40.13,25.91) 40.23,25.81 40.23,23.11 47.34,16 v1(67.94,16) ; 83.21,20.31 82.11,20.31 v1(78.23,16.43)
  Bottom Layer w0.305: v1(40.13,25.91) 40.89,25.91 45.21,30.23 45.72,30.23 v1(46.23,30.73)
  Bottom Layer w0.381: v1(67.94,16) 68.37,16.43 v1(78.23,16.43)
CS3: length 113.7
  Top Layer w0.305: v1(82.14,38.48) 82.26,38.6 82.88,38.6 ; U23.14 47.58,30.44 v1(47.75,30.61) ; v1(85.6,9.08) 89.61,13.09 89.61,37.5 ; 68.5,10.49 47.02,10.49 36.34,21.18 v1(36.34,21.94)
  Bottom Layer w0.305: v1(36.34,21.94) 36.34,22.8 38.1,24.56 38.1,27.69 42.29,31.88 46.99,31.88 47.75,31.12 v1(47.75,30.61) ; 82.13,38.55 82.13,38.52 82.59,38.07 89.01,38.07 v1(89.58,37.49) ; 85.6,9.1 84.68,9.1 83.44,10.34 v1(68.61,10.34)
D+: length 10.3
  Top Layer w0.305: v1(38.35,55.75) 37.59,55.75 37.48,55.64 USB1.8 ; 39.12,51.81 39.24,51.69 39.24,51.05 U19.1 ; 39.12,51.81 v1(39.12,52.58) ; 39.12,51.81 38.48,52.45 USB1.6
  Bottom Layer w0.305: v1(38.35,55.75) 38.86,55.25 38.86,52.83 v1(39.12,52.58)
D-: length 11.7
  Top Layer w0.305: USB1.7 37.98,51.69 ; 37.98,51.69 v1(37.47,52.2) ; 37.98,51.69 38.1,51.56 U19.2 ; v1(37.59,56.39) 38.73,56.39 38.98,56.15 USB1.5
  Bottom Layer w0.305: v1(37.59,56.39) 37.47,56.26 v1(37.47,52.2)
EN: length 24.2
  Top Layer w0.305: 62,45.57 62.33,45.24 62.89,45.24 63.3,45.65 63.3,45.66 ; 62,45.57 61.74,45.3 61.57,45.3 61.34,45.07 v1(61.34,44.58) ; 62,45.57 U24.26 ; 63.3,45.66 63.73,45.24 64.42,45.24 64.6,45.43 U24.22 ; 63.3,45.66 U24.24 ; v1(57.78,39.37) 53.22,34.8 U23.24
  Bottom Layer w0.305: v1(61.34,44.58) 61.09,44.83 59.82,44.83 58.93,43.94 58.93,40.51 v1(57.78,39.37)
EN2: length 24.9
  Top Layer w0.305: v1(61.09,27.05) 61.47,27.05 61.93,27.52 61.93,27.6 ; U28.24 63.25,28.37 63.25,27.43 ; v1(58.42,30.86) 58.93,31.37 58.93,33.27 v1(58.04,34.16) ; 63.25,27.43 63.48,27.2 64.28,27.2 64.53,27.45 U28.22 ; 63.25,27.43 63.01,27.2 62.34,27.2 61.93,27.6 ; 61.93,27.6 U28.26 ; U23.25 51.81,35.3 v1(52.2,35.69)
  Bottom Layer w0.305: v1(61.09,27.05) 60.83,26.8 60.07,26.8 59.82,27.05 59.82,28.32 58.42,29.72 v1(58.42,30.86) ; v1(58.04,34.16) 57.21,34.16 55.69,35.69 v1(52.2,35.69)
ENCODER2_SCL: length 50.5
  Top Layer w0.305: U23.22 55.93,33.8 v1(56.15,34.02)
  Bottom Layer w0.305: 91.72,11.61 87.48,11.61 65.56,33.53 57.1,33.53 56.61,34.02 v1(56.15,34.02)
ENCODER2_SDA: length 62.5
  Top Layer w0.305: U23.42 44.08,39.13 v1(44.07,39.12)
  Bottom Layer w0.305: 49.62,37.48 44.79,37.48 44.07,38.2 v1(44.07,39.12) ; 56.04,33.16 54.23,34.97 51.79,34.97 51.38,35.38 51.38,35.74 49.63,37.49 ; 56.04,33.12 65.35,33.12 89.43,9.04 91.72,9.04
ENCODER_SCL: length 70.8
  Top Layer w0.305: v1(46.48,46.36) 45.47,46.36 44.58,45.47 44.58,43.43 45.08,42.93 U23.40
  Bottom Layer w0.305: 92.14,44.67 91.95,44.85 89.51,44.85 87.09,47.27 62,47.27 56.39,52.88 56.39,56.39 57.4,57.4 57.4,58.04 56.64,58.8 54.58,58.8 U35.3 53.44,53.31 v1(46.48,46.36)
ENCODER_SDA: length 63.9
  Top Layer w0.305: U23.41 44.58,42.03 v1(44.45,42.16)
  Bottom Layer w0.305: 55.88,52.81 55.88,57.6 U35.4 ; 55.88,52.81 53.51,52.81 47.12,46.42 47.12,44.83 v1(44.45,42.16) ; 55.88,52.81 61.83,46.86 85.77,46.86 90.22,42.41 92.29,42.41 92.29,42.29
IN1: length 31.7
  Top Layer w0.305: v1(52.32,31.12) 54.04,31.12 59.06,36.13 ; U24.27 61.35,45.71 60.58,44.93 v1(60.58,44.2) ; 59.05,36.17 59.05,37.52 v1(59.1,37.57) ; v1(48.51,27.56) 48.51,27.27 47.66,26.42 46.79,26.42 45.41,27.79 44.98,27.79 44.58,28.19 U23.8
  Bottom Layer w0.305: v1(48.51,27.56) 52.2,31.24 ; v1(60.58,44.2) 59.69,43.31 59.69,38.16 v1(59.1,37.57)
IN2: length 28.1
  Top Layer w0.305: v1(62.61,49.53) 53.18,49.53 51.69,48.04 51.69,45.85 51.18,45.34 46.35,45.34 v1(45.97,44.96) ; v1(62.61,48.01) 62.65,47.96 U24.25 ; v1(44.2,42.93) 43.94,42.67 43.94,42.42 43.58,42.06 U23.43
  Bottom Layer w0.305: v1(45.97,44.96) 44.2,43.18 v1(44.2,42.93) ; v1(62.61,49.53) v1(62.61,48.01)
IN2_1: length 25.7
  Top Layer w0.305: U28.27 61.28,30.04 v1(61.34,30.1) ; U23.38 46.08,42.02 46.84,42.77 49.17,42.77 v1(52.07,39.88) ; v1(60.2,32.13) v1(60.2,34.54)
  Bottom Layer w0.305: v1(52.07,39.88) 52.38,39.88 57.49,34.77 59.97,34.77 v1(60.2,34.54) ; v1(60.2,32.13) 60.2,31.24 v1(61.34,30.1)
IN2_2: length 28.8
  Top Layer w0.305: U28.25 62.58,29.94 v1(62.74,30.1) ; U23.39 45.58,42.09 46.67,43.18 49.66,43.18 v1(51.82,41.02) ; v1(62.74,32.39) 62.74,34.67 v1(62.23,35.18)
  Bottom Layer w0.305: v1(62.74,32.39) v1(62.74,30.1) ; v1(62.23,35.18) 57.66,35.18 v1(51.82,41.02)
IN2_3: length 29
  Top Layer w0.305: U23.62 40.22,32.3 40.52,32 48.14,32 v1(48.39,31.75) ; v1(58.29,31.62) 55.12,31.62 53.97,30.48 50.16,30.48 v1(49.91,30.73) ; U28.23 63.88,30.1
  Bottom Layer w0.305: v1(48.39,31.75) 49.4,30.73 v1(49.91,30.73) ; v1(63.88,30.1) 63.88,29.85 63.58,29.54 61.01,29.54 58.93,31.62 v1(58.29,31.62)
IN3: length 30.8
  Top Layer w0.305: v1(63.63,50.17) 63.55,50.09 53.16,50.09 51.18,48.1 51.18,46.1 50.88,45.8 45.8,45.8 v1(45.59,45.59) ; v1(63.75,48.01) 63.95,47.81 U24.23 ; v1(43.43,42.93) 43.43,42.55 43.08,42.19 U23.44
  Bottom Layer w0.305: v1(45.59,45.59) 45.59,45.49 43.43,43.33 v1(43.43,42.93) ; v1(63.63,50.17) 63.63,48.13 v1(63.75,48.01)
KEY1: length 65.2
  Top Layer w0.305: U23.33 48.88,41.1 v1(48.88,42.18) ; 22.27,25.35 21.34,26.29 17.94,26.29 C41.1 15.24,23.59 15.24,17.52 SW11.1 ; 22.27,25.35 R44.2 ; 22.27,25.35 23.58,25.35 v1(23.8,25.13) ; SW11.2 23.8,18.36 v1(23.75,18.42)
  Bottom Layer w0.305: v1(48.88,42.18) 48.88,42.43 48.04,43.27 46.35,43.27 44.48,41.4 34.04,41.4 33.02,40.39 33.02,31.44 26.72,25.13 v1(23.8,25.13) 23.75,25.08 v1(23.75,18.42)
KEY2: length 71.1
  Top Layer w0.305: C42.1 19.19,19.94 ; 19.19,19.94 20.57,19.94 22.25,21.61 R45.2 v1(24.51,22.35) ; 19.19,19.94 19.19,13.59 SW12.2 SW12.1 ; v1(48.13,42.16) 48.08,42.11 U23.34
  Bottom Layer w0.305: v1(24.51,22.35) 33.53,31.37 33.53,40.13 34.29,40.89 44.54,40.89 46.52,42.87 47.43,42.87 v1(48.13,42.16)
KEY3: length 123.5
  Top Layer w0.305: v1(44.7,38.74) 44.4,38.43 43.36,38.43 43.05,38.74 42.16,38.74 v1(41.53,38.1) ; C43.1 73.67,5.96 69.85,9.78 69.85,15.56 SW13.2 SW13.1 48.3,17.36 v1(48.13,17.53) ; v1(46.35,38.1) 47.59,39.34 47.59,40.17
  Bottom Layer w0.305: v1(41.53,38.1) 41.53,35.31 28.7,22.48 26.31,22.48 24.64,20.81 24.64,18.42 17.53,11.3 17.53,9.91 25.7,1.68 32.4,1.68 48.12,17.4 ; 48.13,17.38 v1(48.13,17.53) ; v1(46.35,38.1) 45.72,38.74 v1(44.7,38.74)
KEY4: length 80
  Top Layer w0.305: v1(42.29,37.97) 45.34,37.97 47.04,39.67 47.04,40.19 ; R47.2 77.59,7.1 76.2,5.72 76.2,4.45 C44.1 76.21,3.94 75.69,3.43 71.75,3.43 71.12,4.06 71.12,5.78 SW14.2 SW14.1 47.15,8.85 v1(34.54,21.46)
  Bottom Layer w0.305: v1(42.29,37.97) 42.29,34.99 34.54,27.24 v1(34.54,21.46)
KEY5: length 109.1
  Top Layer w0.305: 46.58,41.68 46.58,41.94 46.85,42.21 v1(47.11,42.21) ; 68,35.26 67.9,35.36 64.28,35.36 ; 87.12,39.51 88.36,38.27 88.36,20.33 83.13,15.1 82.47,15.1 ; 72.7,14.95 SW15.2 83.69,13.06 83.69,9.58 R53.2 81.48,6.81 80,5.32 C50.1
  Inner2 w0.305: v1(55.25,43.05) 51.56,46.74 v1(51.56,49.78)
  Bottom Layer w0.305: 64.26,35.34 64.24,35.36 63.32,35.36 ; v1(87.12,39.47) 86.71,39.06 81.44,39.06 81.23,39.26 76.04,39.26 72.14,35.36 ; 72.21,35.28 72.19,35.3 72.08,35.3 ; v1(51.56,49.78) 50.71,48.93 50.71,45.01 49.66,43.96 49.66,42.15 49.05,41.54 47.78,41.54 v1(47.11,42.21) ; 67.88,35.3 72.08,35.3 ; 72.08,35.3 72.08,35.29 ; v1(55.25,43.05) 55.25,40.31 59.63,35.93 62.74,35.93 63.31,35.36
  vias: v1(64.26,35.3) v1(67.96,35.3)
LCD_CS1: length 33.5
  Top Layer w0.305: U23.26 50.54,35.76 48.2,35.76 v1(46.86,34.42) ; FPC4.8 30.2,15.78 29.97,16 29.97,17.96 37.21,25.2 v1(37.21,25.27)
  Bottom Layer w0.305: v1(46.86,34.42) 42.87,34.42 37.52,29.07 37.52,25.58 v1(37.21,25.27)
LCD_CS2: length 29.1
  Top Layer w0.305: U23.54 43.96,36.3 v1(44.07,36.2) ; U36.8 32.47,21.32 36.7,25.55 v1(36.7,25.78)
  Bottom Layer w0.305: v1(36.7,25.78) 36.7,28.83 v1(44.07,36.2)
LCD_DC: length 42.9
  Top Layer w0.305: FPC4.4 29.52,13.78 29.21,13.46 29.21,12.44 U36.4 ; v1(52.07,33.15) 51.72,32.8 U23.20
  Bottom Layer w0.305: v1(52.07,33.15) 52.45,33.15 53.21,32.39 53.21,30.61 v1(48.13,25.53) 36.45,13.84 30.61,13.84 U36.4
LCD_RST: length 47
  Top Layer w0.305: U23.18 53.77,31.8 v1(53.85,31.88) ; FPC4.3 29.91,13.28 29.62,12.98 29.62,12.09 29.21,11.68 29.21,9.94 U36.3
  Bottom Layer w0.305: v1(53.85,31.88) 53.85,30.35 v1(48.89,25.4) 36.83,13.34 31.12,13.34 29.34,11.56 29.34,10.07 U36.3
LCD_SCL: length 37.6
  Top Layer w0.305: U23.19 52.11,32.3 v1(52.2,32.39) ; U36.6 28.7,15.71 28.7,15.11 29.08,14.73 31.31,14.73 FPC4.6
  Bottom Layer w0.305: v1(52.2,32.39) 52.2,32.03 48.63,28.47 47.39,28.47 46.35,27.43 46.35,26.19 44.93,24.77 41.28,24.77 32.83,16.32 U36.6
LCD_SDA: length 37.3
  Top Layer w0.305: U23.21 50.54,33.26 49.51,33.26 49.07,32.82 49.07,27.26 47.22,25.4 v1(47.12,25.4) ; U36.5 28.81,13.82 29.26,14.28 FPC4.5
  Bottom Layer w0.305: U36.5 28.62,14.35 36.07,14.35 v1(47.12,25.4)
LED: length 27.1
  Top Layer w0.305: 49.72,44.2 50.89,44.2
  Bottom Layer w0.305: 42.47,40.28 42.28,40.08 42.29,40.06 42.29,38.83 44.25,36.88 48.34,36.88 48.64,36.58 48.64,32.39 49.66,31.37 50.29,31.37 v1(50.42,31.24) ; 50.8,44.07 50.8,42.67 48.41,40.28 42.47,40.28
  vias: v1(50.89,44.2)
OUT1: length 33.5
  Top Layer w0.305: 94.91,37.86 91.16,37.86 90.98,37.68
  Top Layer w0.381: 82.14,49 78.3,49 ; U25.5 82.18,49.02 ; 78.17,48.88 76.89,47.6 ; 76.89,47.24 77.91,47.24 v1(78.89,46.25)
  Bottom Layer w0.508: v1(78.89,46.25) 78.92,46.23 85.34,46.23 87.37,44.21 87.37,42.17 91.66,37.88 95.04,37.88 95.1,37.94
OUT1_CS: length 34.2
  Top Layer w0.381: 82.7,49.71 75.75,49.71 73.7,47.66 73.7,47.43 ; U24.5 63.3,38.3 65.42,36.18 69.94,36.18 70.38,36.62 v1(70.38,36.85)
  Top Layer w0.508: 74.14,47.26 74.1,47.22 71.79,47.22 70.68,46.11
  Bottom Layer w0.305: v1(70.38,36.85) 70.38,45.74 v1(70.74,46.1)
OUT1_CS2: length 35.5
  Top Layer w0.305: 74.02,30.28 74.02,30.37
  Top Layer w0.381: 70.85,25.02 70.85,26.75 71.79,27.69 71.83,27.69 73.86,29.72 73.86,30.07 ; v1(72.62,20.42) 72.62,19.14 72.19,18.71 70.46,18.71 70.43,18.67 65.28,18.67 63.23,20.71 U28.5
  Top Layer w0.508: 74.02,30.37 76.38,32.73 83.1,32.73
  Bottom Layer w0.381: 70.79,25.06 72.62,23.23 v1(72.62,20.42)
  vias: v1(70.81,25.04)
OUT2: length 29.2
  Top Layer w0.305: 90.92,35.54 91.08,35.38 94.93,35.38
  Top Layer w0.508: 79.68,44.01 78.81,44.01 ; 79.68,44.01 82.87,44.01 ; 79.68,44.01 80.44,43.14 ; 78.81,44.06 78.14,44.73 77.28,44.73 ; 80.44,43.14 80.3,43.28 ; 80.44,43.14 v1(82.04,41.53)
  Bottom Layer w0.508: 95.04,35.52 94.92,35.4 92.87,35.4 86.74,41.53 v1(82.04,41.53)
OUT2_1: length 26.7
  Top Layer w0.305: 95.13,28.75 91.08,28.75 90.86,28.52
  Top Layer w0.508: 80.98,30.33 80.98,31.33 81.68,32.02 83.22,32.02 ; 76.87,30.23 81.09,30.23
  Bottom Layer w0.508: 95.04,28.45 82.88,28.45 v1(81.15,30.18)
OUT2_2: length 25.7
  Top Layer w0.305: 95.09,26.18 94.95,26.32 90.86,26.32
  Top Layer w0.381: 76.87,27.5 80.64,27.5 ; 80.67,27.54 v1(81.28,26.92)
  Top Layer w0.508: 83.21,26.8 83.18,26.76 81.44,26.76 v1(81.28,26.92)
  Bottom Layer w0.508: v1(81.28,26.92) 81.28,26.67 82.64,25.31 94.59,25.31 95.06,25.78
OUT2_3: length 32
  Top Layer w0.305: 90.92,23.72 95.31,23.72 95.36,23.68
  Top Layer w0.381: 78.99,23.05 80.23,23.05 82.29,20.99 83.1,20.99 ; 77.08,24.33 77.67,24.33 79.01,22.99
  Bottom Layer w0.508: 94.94,23.36 92.4,23.36 87.2,18.16 83.86,18.16 v1(79.01,23.01)
OUT2_CS: length 27.7
  Top Layer w0.381: v1(72.14,39.47) 72.14,39.46 69.48,36.8 66.96,36.8 65.25,38.51 U24.8
  Top Layer w0.508: 82.8,44.67 79.07,44.67 78.25,45.48 78.25,45.83 77.89,46.19 75.59,46.19 74.39,44.99 73.95,44.99 ; 72.4,44.58 73.87,44.58
  Bottom Layer w0.508: 72.4,44.52 72.4,39.73 v1(72.14,39.47)
  vias: v1(72.42,44.52)
OUT2_CS2: length 28.1
  Top Layer w0.381: v1(71.32,19.32) 66.41,19.32 65.18,20.54 U28.8 ; 83.18,27.44 82,28.62 76.04,28.62 74.86,27.44 74.09,27.44
  Top Layer w0.508: v1(71.45,22.78) 72.31,23.64 72.31,25.62 74.11,27.42
  Bottom Layer w0.381: v1(71.32,19.32) 71.32,22.65 v1(71.45,22.78)
OUT3: length 33.9
  Top Layer w0.305: 90.92,32.77 94.95,32.77 95.07,32.9
  Top Layer w0.508: 77.06,41.88 77.06,39.29 ; 77.06,39.29 77,39.29 ; 77.06,39.29 82.63,39.29 ; 77.06,39.09 76.75,38.78
  Bottom Layer w0.508: 95.14,32.83 94.98,32.68 92.8,32.68 88.18,37.3 82.21,37.3 80.77,38.74 76.71,38.74 76.7,38.73 v1(76.7,38.7)
OUT3_CS: length 23.9
  Top Layer w0.381: U24.9 65.9,38.62 66.93,37.59 68.53,37.59 73.45,42.51 73.95,42.51 ; 74.33,42.51 74.01,42.51
  Top Layer w0.508: 73.95,42.45 74.98,43.49 77.95,43.49 81.31,40.13 82.65,40.13 82.88,39.9 ; 73.99,42.51 73.99,42.67
OUT3_CS2: length 24
  Top Layer w0.381: 83.24,21.6 82.98,21.6 78.77,25.82 75.98,25.82 74.82,24.66 74.11,24.66 ; U28.9 65.83,20.78 66.62,20 70.19,20 74.09,23.89 74.09,24.47
RST: length 51.1
  Top Layer w0.305: 12.38,10.66 12.38,9.91 ; 12.38,10.66 18.15,10.66 v1(18.41,10.92) ; 12.38,10.66 12.38,11.45 R33.1 9.93,13.9 C32.2 ; U23.7 44.08,28.06 44.75,27.39 45.13,27.39 45.72,26.8 v1(45.72,26.54)
  Bottom Layer w0.305: v1(18.41,10.92) 20.19,10.92 26.92,17.65 28.32,17.65 28.51,17.46 33.33,17.46 41.15,25.27 44.45,25.27 v1(45.72,26.54)
SERVO1: length 105
  Top Layer w0.305: v1(23.49,58.55) 30.23,58.55 30.86,57.91 45.09,57.91 48.43,61.26 v1(83.96,61.26) ; v1(34.92,40.13) 31.24,40.13 v1(30.23,41.15) ; v1(40.64,39.12) 40.64,38.21 40.23,37.8 U23.51
  Bottom Layer w0.305: v1(40.64,39.12) 40.64,40.01 40.21,40.44 35.23,40.44 v1(34.92,40.13) ; v1(30.23,41.15) 30.23,48.26 28.45,50.04 25.4,50.04 24.26,51.18 24.26,54.74 22.48,56.52 22.48,57.53 v1(23.49,58.55) ; 86.91,57.03 86.91,58.32 83.97,61.25
SERVO2: length 50.2
  Top Layer w0.305: v1(60.07,50.67) 59.94,50.8 v1(56.51,50.8) ; U23.56 46.35,35.3 v1(49.15,38.1)
  Bottom Layer w0.305: v1(49.15,38.1) 51.18,40.13 51.18,41.28 54.36,44.45 54.36,48.51 56.51,50.67 v1(56.51,50.8) ; 76.93,57.25 76.38,57.25 70.31,51.18 60.58,51.18 v1(60.07,50.67)
SWCLK: length 33.1
  Top Layer w0.305: v1(37.21,43.43) 37.21,38.74 37.64,38.3 U23.50
  Bottom Layer w0.305: v1(37.21,43.43) 37.21,46.1 32.26,51.05 25.91,51.05 25.4,51.56 25.4,58.47 23.49,60.38
SWDIO: length 30.1
  Top Layer w0.305: U23.49 38.03,38.8 37.85,38.99 v1(37.85,43.94)
  Bottom Layer w0.305: JP7.2 27.94,58.47 27.94,51.87 28.25,51.56 32.51,51.56 37.85,46.23 v1(37.85,43.94)
UART1_RX: length 14.3
  Top Layer w0.305: U19.6 36.45,45.18 36.45,38.61 37.03,38.02 37.03,33.96 37.69,33.3 U23.60
UART1_TX: length 13.6
  Top Layer w0.305: v1(37.59,34.67) 37.59,34.16 37.95,33.8 U23.59 ; U19.7 38.48,45.18 v1(38.48,39.37)
  Bottom Layer w0.305: v1(38.48,39.37) 37.59,38.48 v1(37.59,34.67)
UART3_RX: length 41
  Top Layer w0.305: U23.53 46.9,36.8 50.36,40.26 v1(50.42,40.26) ; v1(55.12,50.8) 55.73,51.41 59.16,51.41 60.68,52.93 64.2,52.93 U34.3
  Bottom Layer w0.305: v1(55.12,50.8) 52.73,48.41 52.73,43.45 50.42,41.14 v1(50.42,40.26)
UART3_TX: length 45.2
  Top Layer w0.305: U34.4 69.68,58.17 67.44,58.17 67.06,57.79 67.06,56.39 64.01,53.34 60.32,53.34 58.8,51.82 55.25,51.82 v1(54.48,51.05) ; U23.52 46.83,37.3 49.4,39.88 v1(49.4,40.26)
  Bottom Layer w0.305: v1(54.48,51.05) 52.32,48.9 52.32,43.62 49.4,40.7 v1(49.4,40.26)
VM: length 144.6
  Top Layer w0.305: C56.2 62.67,38.3 v2(62.61,38.35) ; v2(62.6,20.45) 62.67,20.38 C64.2
  Top Layer w0.381: v2(62.6,20.45) 62.6,22.64 U28.4 ; U28.11 67.13,20.77 v2(67.17,20.73) ; U24.4 62.65,38.4 v2(62.61,38.35) ; v2(67.31,38.35) 67.2,38.46 U24.11
  Top Layer w0.762: C51.2 54.23,47.11 v2(54.23,42.83) v2(54.23,40.01) ; v2(54.36,22.67) 54.36,24.1 C66.2 C60.2 54.33,29.91 54.2,29.78 C59.2
  Top Layer w1.016: C27.2 18.1,36.13 19.01,35.22 R26.2 ; C27.2 C26.2 11.24,36.13 11.05,35.94 ; C27.2 16.03,38.9
  Top Layer w2.032: 18.44,35.78 18.32,35.66 18.32,33.15 ; 18.44,31.97 18.41,32 v2(18.41,32.64) ; S4.2 6.98,26.54 D4.2 10.92,30.99 10.92,35.69
  Inner1 w0.762: 54.23,38.07 v2(54.23,40.01) ; 54.23,38.07 54.52,38.35 v2(62.61,38.35) v2(67.31,38.35) ; 54.23,38.07 54.23,37.85 55.12,36.96 55.12,33.15 ; v2(67.17,20.73) 62.88,20.73 v2(62.6,20.45) 55.63,20.45 54.36,21.72 ; 54.36,21.72 54.23,21.59 39.88,21.59 37.72,23.75 21.97,23.75 18.41,27.31 v2(18.41,32.64) ; 54.36,21.72 v2(54.36,22.67) v2(54.36,25.74) v2(54.36,28.67) 54.36,30.1 ; 54.1,30.23 55.12,31.24 55.12,32.89
  Inner1 w2.032: v2(18.41,32.64) 18.41,33.25 18.44,33.27
  vias: v2(17.78,33.53) v2(17.78,31.75) v2(19.05,33.66) v2(19.18,31.75)
$1N15960: length 8.9
  Top Layer w0.381: R27.2 22.55,37.22 R26.1 18.41,37.22 17.27,38.35 17.27,39.62 17.78,40.13 U12.5
$1N15961: length 7.4
  Top Layer w0.762: 15.91,42.67 15.62,42.67 14.1,41.15 13.59,41.15 12.83,40.39 ; U12.2 L2.1
$1N15964: length 9.2
  Top Layer w0.381: 20.7,47.75 19.67,48.77 15.66,48.77 R29.2
  Top Layer w0.762: 14.37,45.57 R28.1 R29.2
$1N15965: length 15.3
  Top Layer w0.381: U12.4 18.37,39.12 18.8,39.12 19.3,39.62 19.3,43.06 R30.2 ; 16.25,47.1 16.49,46.86 20.18,46.86 20.7,46.35
  Top Layer w0.762: 16.38,45.57 16.25,45.69 16.25,47.1 R29.1
$1N16007: length 17.5
  Top Layer w2.032: S4.3 4.06,31.86 4.06,43.54 CN1.2
$1N16014: length 1.9
  Top Layer w0.762: C28.1 18.31,41.95 U12.6
$1N16018: length 2.4
  Top Layer w0.381: 9.72,19.18 10.09,18.81 10.09,16.95
$1N16021: length 2.5
  Top Layer w0.305: 45.2,43.68 47.37,43.68 47.62,43.93
$1N16033: length 2.6
  Top Layer w0.635: 39.37,43.57 39.37,43.14 ; 39.37,43.57 U19.8 ; 39.37,43.57 C47.1
$1N16042: length 2.3
  Top Layer w0.305: USB1.4 39.48,53.86 R51.1
$1N16043: length 2.1
  Top Layer w0.305: R52.1 36.48,52.76 USB1.10
$1N16080: length 3.7
  Top Layer w0.305: X4.1 42.18,26.52 41.91,26.79 43.08,27.97 U23.5
$1N16081: length 3.5
  Top Layer w0.305: X4.3 44.58,26.95 43.58,27.95 U23.6
$1N16176: length 3.9
  Top Layer w0.305: C56.1 61.27,38.4 61.26,38.4 61.98,39.12 61.98,40.67 U24.3
$1N16178: length 14
  Top Layer w0.305: U24.17 67.85,47.9 67.19,48.57 60.76,48.57 58.55,46.36 58.55,45.25 R60.1
$1N16180: length 13.2
  Top Layer w0.305: U24.16 68.5,47.83 67.36,48.97 60.59,48.97 58.78,47.17 R61.1
$1N16187: length 5.1
  Top Layer w0.305: C57.2 58.18,42.16 60.71,42.16 61.35,41.52 U24.2
$1N16188: length 6.4
  Top Layer w0.305: C57.1 56.19,40.31 56.5,40.01 60.4,40.01 60.71,40.31 60.71,40.69 U24.1
$1N16236: length 3.5
  Top Layer w0.305: U28.3 61.93,20.09 C64.1
$1N16238: length 13.2
  Top Layer w0.305: R68.1 57.87,27.9 60.63,30.66 66.37,30.66 67.78,29.25 U28.17
$1N16240: length 12.9
  Top Layer w0.305: U28.16 68.45,28.41 68.45,29.59 66.98,31.06 60.4,31.06 59.31,29.97 R69.1
$1N16247: length 4.5
  Top Layer w0.305: C65.2 60.32,24.38 61.28,23.43 U28.2
$1N16248: length 6
  Top Layer w0.305: U28.1 60.33,22.35 56.9,22.35 56.59,22.65 C65.1
$1N16306: length 3.5
  Top Layer w0.305: H2#3.2 26.67,53.71 R31.1
$1N16948: length 2.2
  Top Layer w0.305: R67.1 65.68,32.15 63.88,32.15 LED5.1
$1N16951: length 16.4
  Top Layer w0.305: v1(59.06,30.61) 59.94,31.5 60.78,31.5 LED5.2 ; U28.18 67.13,29.26 66.29,30.1 v1(64.9,30.1)
  Bottom Layer w0.305: v1(64.9,30.1) 64.9,27.81 64.64,27.56 61.72,27.56 59.06,30.23 v1(59.06,30.61)
$1N17080: length 2.7
  Top Layer w0.305: 63.3,51.23 65.96,51.23 R59.1
$1N17085: length 12.1
  Top Layer w0.305: LED6.2 62.23,52.36 66.51,52.36 66.8,52.07 v1(66.8,49.66) ; U24.18 67.2,47.6 v1(66.8,48.01)
  Bottom Layer w0.305: v1(66.8,48.01) v1(66.8,49.66)

## Copper pours and planes (outline as drawn; the poured copper is in the pictures)
GND on Top Layer: -5.4,66.74 101.99,66.74 101.99,-0.79 -5.4,-0.79
GND on Bottom Layer: -3.62,78.75 103.62,78.75 103.62,-7.17 -3.62,-7.17
GND on Inner1: -0.53,67.78 102.38,67.78 102.38,-2.84 -0.53,-2.84
GND on Inner2: -2.7,69.48 102.23,69.48 102.23,-4.39 -2.7,-4.39

Small or netless copper shapes (teardrops, artwork), in the pictures only: 498 on Top Layer, 152 on Bottom Layer, 49 on Inner1, 2 on Inner2

## Text on the board
Top Silkscreen Layer: [GND 3V3] | [CLK->3V3] | [GND 3V3 SCL SDA] | [GND 3V3 3_TX 3_RX] | [PWM2 5V GND] | [PWM1 5V GND] | [CANH CANL] | TwisterDriver V2.0 / Created By Nino / --2023.5.30 | RST | [↑ON↓OFF] | ↑KEY1 | ↓KEY2 | ↑KEY3 | ↓KEY4 | →KEY5 | ENCODER1 | ENCODER2 | BLDC1 | BLDC2
